# EAGLE design FD1 (EAGLE 9.4.1)
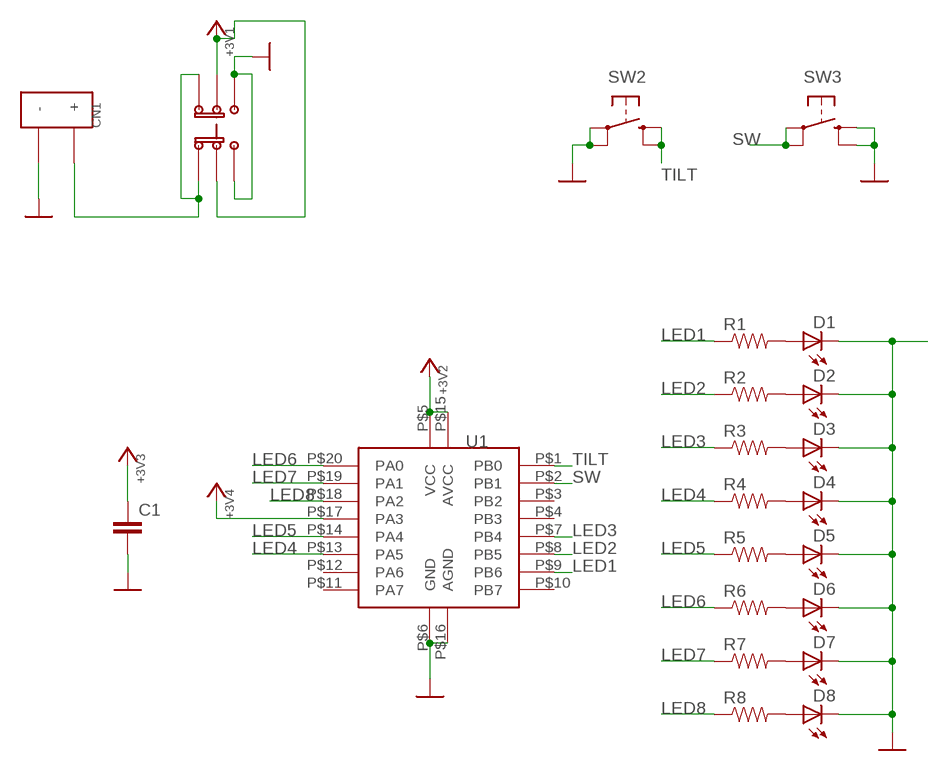
[diagram p0: schematic, sheet 1]

## Parts
C1  CAPTH_5MML  [CAP_TH_5MM_L]
CN1  BAT_UM3X2  [BAT_UM3X2]
D1  LED5MM  [SPARKFUN_LED5MM]
D2  LED5MM  [SPARKFUN_LED5MM]
D3  LED5MM  [SPARKFUN_LED5MM]
D4  LED5MM  [SPARKFUN_LED5MM]
D5  LED5MM  [SPARKFUN_LED5MM]
D6  LED5MM  [SPARKFUN_LED5MM]
D7  LED5MM  [SPARKFUN_LED5MM]
D8  LED5MM  [SPARKFUN_LED5MM]
R1  RESTH_10MML  [R_TH_10MM_L]
R2  RESTH_10MML  [R_TH_10MM_L]
R3  RESTH_10MML  [R_TH_10MM_L]
R4  RESTH_10MML  [R_TH_10MM_L]
R5  RESTH_10MML  [R_TH_10MM_L]
R6  RESTH_10MML  [R_TH_10MM_L]
R7  RESTH_10MML  [R_TH_10MM_L]
R8  RESTH_10MML  [R_TH_10MM_L]
SW2  SW_TACTRBS04021-G  [SW_RBS040210-G]
SW3  SW_TACTTH_L  [SW_TACT_L]
SW4  SW_IS-1250IS2235  [SW_IS2235]
U1  MCU_ATTINY861PU  [DIP20]

## Nets
+3V3: C1.1 SW4.P$C1 SW4.P$C2 U1.P$5(VCC) U1.P$15(AVCC) U1.P$17(PA3) ; supply symbol labelled POW_+3V3
GND: C1.2 CN1.P$M(-) D1.K(C) D2.K(C) D3.K(C) D4.K(C) D5.K(C) D6.K(C) D7.K(C) D8.K(C) SW2.P$1(P) SW2.P$2(P1) SW3.P$3(S) SW3.P$4(S1) SW4.P$B1 SW4.P$B2 U1.P$6(GND) U1.P$16(AGND) ; supply symbol labelled POW_GND
LED1: R1.1 U1.P$9(PB6)
LED2: R2.1 U1.P$8(PB5)
LED3: R3.1 U1.P$7(PB4)
LED4: R4.1 U1.P$13(PA5)
LED5: R5.1 U1.P$14(PA4)
LED6: R6.1 U1.P$20(PA0)
LED7: R7.1 U1.P$19(PA1)
LED8: R8.1 U1.P$18(PA2)
N$1: CN1.P$P(+) SW4.P$A1 SW4.P$A2
N$3: D1.A R1.2
N$4: D2.A R2.2
N$5: D3.A R3.2
N$6: D4.A R4.2
N$7: D5.A R5.2
N$8: D6.A R6.2
N$9: D7.A R7.2
N$10: D8.A R8.2
SW: SW3.P$1(P) SW3.P$2(P1) U1.P$2(PB1)
TILT: SW2.P$3(S) SW2.P$4(S1) U1.P$1(PB0)
Unconnected: U1.P$3(PB2) U1.P$4(PB3) U1.P$10(PB7) U1.P$11(PA7) U1.P$12(PA6)

## Library data of the parts
C1 = akita:CAP: Capacitor Standard 0603 ceramic capacitor, and 0.1" leaded capacitor.
CN1 = akita:BAT_UM3X2: UM3x2 Battery Holder, Akizuki's BH-321-P24
D1-D8 = akita:LED: LEDs Standard schematic elements and footprints for 5mm, 3mm, 1206, and 0603 sized LEDs. 5mm - Spark Fun Electronics SKU : COM-00529 (and others)
R1-R8 = akita:RES: Resistor Basic schematic elements and footprints for 0603, 1206, and PTH resistors.
SW2 SW3 = akita:SW_TACT: OMRON SWITCH
SW4 = akita:SW_IS-1250
U1 = akita:MCU_ATTINY861: Microchip's ATtiny861

## Board
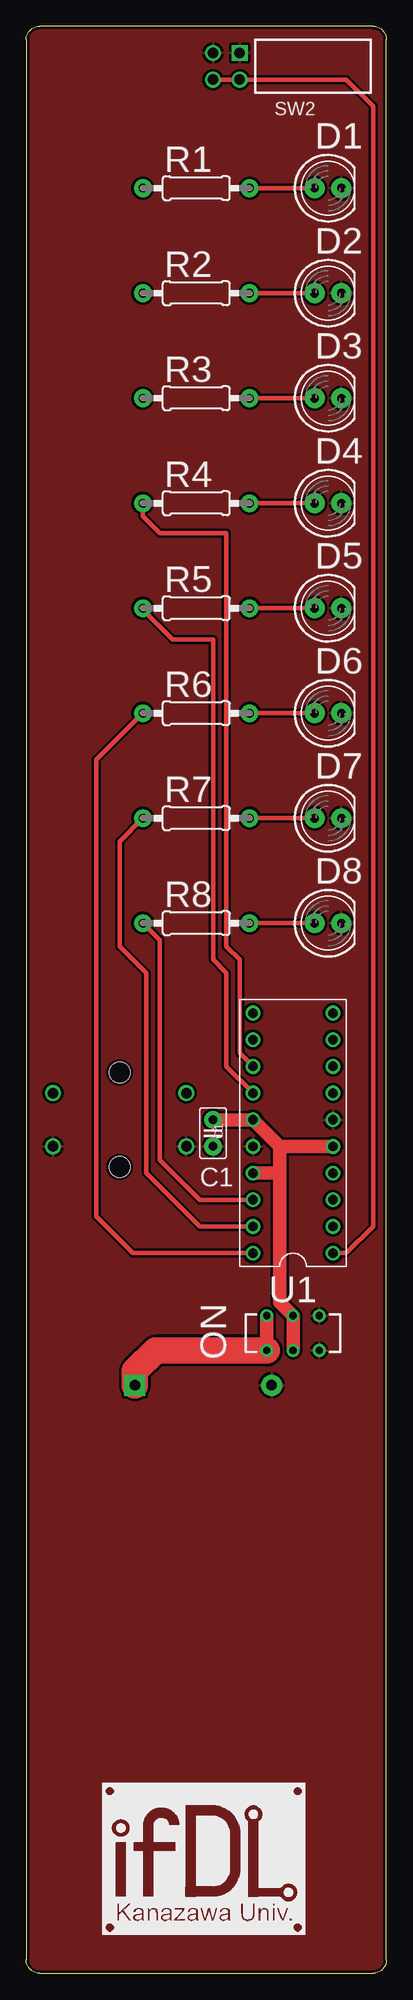
[diagram p1: board, top side]
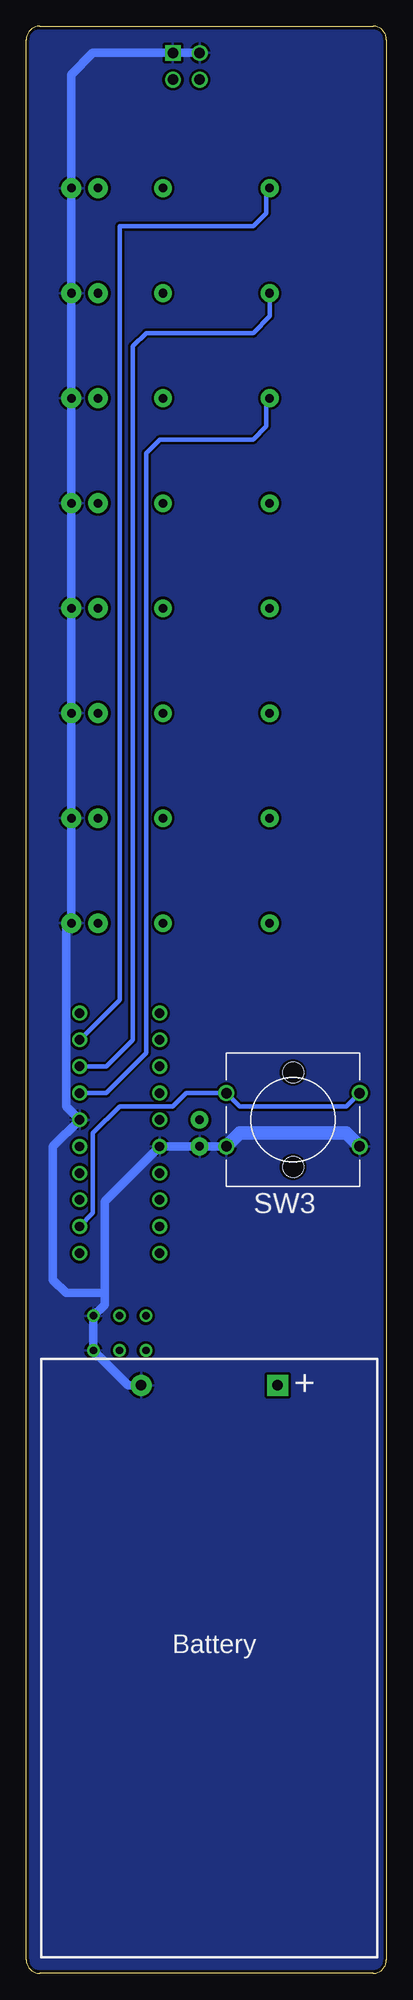
[diagram p2: board, bottom side, seen from below]

Size 34.29 x 185.42 mm. Coordinates in mm from the lower left corner, seen from the top.
Outline: 1.27,0 33.02,0 arc90 34.29,1.27 34.29,184.15 arc90 33.02,185.42 1.27,185.42 arc90 0,184.15 0,1.27 arc90 1.27,0
Copper layers (1*16): Top 0.035mm / dielectric 1.5mm / Bottom 0.035mm
Design rules "SeeedStudio_2layer_DRU_no_angle_20140221": minimum track width 6mil, minimum drill 12mil, track to track 6mil, track to pad 6mil, pad to pad 6mil, via to via 6mil, smd to smd 0mil, copper to edge 10mil, drill to drill 10mil, minimum pad ring 10mil, minimum via ring 6mil, stop-mask expansion 2mil, vias tented up to drill 100mil, thermal gap 10mil

### Footprints (pad centres in the part's own frame; a part is rotated, then mirrored left to right if it is on the bottom)
CAP_TH_5MM_L = drill 0.813 pad 1.676: 1 -1.27,0; 2 1.27,0
BAT_UM3X2 = drill 1 pad 2: P$M -6.5,26 | drill 1 pad 2 square: P$P 6.5,26
SPARKFUN_LED5MM = drill 0.813 pad 1.88: A -1.27,0; K 1.27,0
R_TH_10MM_L = drill 0.813 pad 1.676: 1 -5.08,0; 2 5.08,0
SW_RBS040210-G = drill 1 square: P$1 -1.27,0 | drill 1: P$2 -1.27,-2.54; P$3 1.27,0; P$4 1.27,-2.54
SW_TACT_L = drill 1: P$1 -2.54,-6.35; P$2 -2.54,6.35; P$3 2.54,6.35; P$4 2.54,-6.35 | hole 2: -4.5,0; 4.5,0
SW_IS2235 = drill 0.7: P$A1 -2.5,-1.65; P$A2 -2.5,1.65; P$B1 2.5,-1.65; P$B2 2.5,1.65; P$C1 0,-1.65; P$C2 0,1.65
DIP20 = drill 0.9: P$1 -11.43,-3.81; P$2 -8.89,-3.81; P$3 -6.35,-3.81; P$4 -3.81,-3.81; P$5 -1.27,-3.81; P$6 1.27,-3.81; P$7 3.81,-3.81; P$8 6.35,-3.81; P$9 8.89,-3.81; P$10 11.43,-3.81; P$11 11.43,3.81; P$12 8.89,3.81; P$13 6.35,3.81; P$14 3.81,3.81; P$15 1.27,3.81; P$16 -1.27,3.81; P$17 -3.81,3.81; P$18 -6.35,3.81; P$19 -8.89,3.81; P$20 -11.43,3.81

### Placement (x,y rotation side)
C1  17.78,80.01 270 top
CN1  16.85,30 0 bottom
D1  28.73,170 0 top
D2  28.73,160 0 top
D3  28.73,150 0 top
D4  28.73,140 0 top
D5  28.73,130 0 top
D6  28.73,120 0 top
D7  28.73,110 0 top
D8  28.73,100 0 top
R1  16.19,170 0 top
R2  16.19,160 0 top
R3  16.19,150 0 top
R4  16.19,140 0 top
R5  16.19,130 0 top
R6  16.19,120 0 top
R7  16.19,110 0 top
R8  16.19,100 0 top
SW2  20.32,181.61 270 top
SW3  8.89,81.28 270 bottom
SW4  25.4,60.96 0 top
U1  25.4,80.01 90 top

### Tracks (layer width: path | path; a pad name or v marks a point on that pad's centre or on a via)
+3V3
  Top 1.27: SW4.P$C1 SW4.P$C2 24.13,63.88 24.13,76.2 | C1.1 U1.P$15 24.13,78.74 | 24.13,76.2 U1.P$17 | U1.P$5 24.13,78.74 | 24.13,78.74 24.13,76.2
GND
  Bottom 0.813: CN1.P$M 24.59,56 SW4.P$B1 SW4.P$B2 26.84,63.67 26.84,64.77 | SW2.P$2 SW2.P$1 27.94,182.88 30,180.82 D1.K D2.K D3.K D4.K D5.K D6.K D7.K D8.K 30.48,99.52 30.48,82.55 U1.P$6 31.75,78.74 31.75,66.04 30.48,64.77 26.84,64.77 | 26.84,64.77 26.84,73.49 U1.P$16 C1.2 SW3.P$4
  Bottom 1.27: SW3.P$3 3.81,80.01 13.97,80.01 SW3.P$4
  pour Top (isolate 0.254): 0,0 34.29,0 34.29,185.42 0,185.42 0,1.27
  pour Bottom (isolate 0.254): 0,185.42 34.29,185.42 34.29,0 0,0
LED1
  Bottom 0.406: U1.P$9 25.4,92.71 25.4,166.37 12.7,166.37 11.43,167.64 11.43,169.68 R1.1
LED2
  Bottom 0.406: R2.1 11.11,157.8 12.7,156.21 22.86,156.21 24.13,154.94 24.13,88.9 26.67,86.36 U1.P$8
LED3
  Bottom 0.406: R3.1 11.43,149.68 11.43,147.32 12.7,146.05 21.59,146.05 22.86,144.78 22.86,87.63 26.67,83.82 U1.P$7
LED4
  Top 0.406: U1.P$13 20.32,87.63 20.32,96.52 19.05,97.79 19.05,137.16 12.7,137.16 11.11,138.75 R4.1
LED5
  Top 0.406: U1.P$14 19.05,86.36 19.05,95.25 17.78,96.52 17.78,127 13.97,127 11.11,129.86 R5.1
LED6
  Top 0.406: U1.P$20 10.16,68.58 6.67,72.07 6.67,106.68 6.67,107.25 6.67,115.56 R6.1
LED7
  Top 0.406: U1.P$19 16.51,71.12 11.43,76.2 11.43,95.25 8.89,97.79 8.89,107.78 R7.1
LED8
  Top 0.406: R8.1 12.7,98.41 12.7,77.47 16.51,73.66 U1.P$18
N$1
  Top 1.27: SW4.P$A2 SW4.P$A1
  Top 2.54: SW4.P$A1 12.32,59.31 10.35,57.34 CN1.P$P
N$3
  Top 0.406: R1.2 D1.A
N$4
  Top 0.406: R2.2 D2.A
N$5
  Top 0.406: R3.2 D3.A
N$6
  Top 0.406: R4.2 D4.A
N$7
  Top 0.406: R5.2 D5.A
N$8
  Top 0.406: D6.A R6.2
N$9
  Top 0.406: R7.2 D7.A
N$10
  Top 0.406: R8.2 D8.A
SW
  Bottom 0.406: SW3.P$2 3.81,82.55 13.97,82.55 SW3.P$1 19.05,83.82 20.32,82.55 25.4,82.55 27.94,80.01 27.94,72.39 U1.P$2
TILT
  Top 0.406: SW2.P$4 SW2.P$3 30.48,180.34 33.02,177.8 33.02,71.12 30.48,68.58 U1.P$1

### Text on the board
tPlace: ON
tNames: C1
bNames: Battery